# EAGLE design The electronic speed controller schematic (EAGLE 9.4.2)

## Sheet 1 of 6
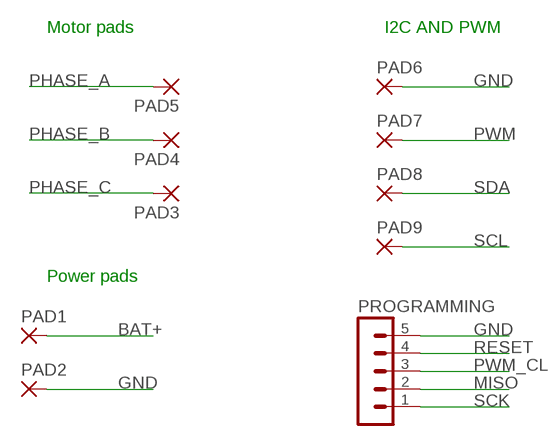
[diagram p0: schematic, sheet 1]

### Parts
PAD1  SMD5  [SMD2,54-5,08]
PAD2  SMD5  [SMD2,54-5,08]
PAD3  SMD5  [SMD2,54-5,08]
PAD4  SMD5  [SMD2,54-5,08]
PAD5  SMD5  [SMD2,54-5,08]
PAD6  SMD2  [SMD1,27-2,54]
PAD7  SMD2  [SMD1,27-2,54]
PAD8  SMD2  [SMD1,27-2,54]
PAD9  SMD2  [SMD1,27-2,54]
PROGRAMMING  MA05-1  [MA05-1]

### Nets
BAT+: PAD1.1(P) ; also sheet 3,4
GND: PAD2.1(P) PAD6.1(P) PROGRAMMING.5 ; also sheet 2,3,4,5,6
MISO: PROGRAMMING.2 ; also sheet 2
PHASE_A: PAD5.1(P) ; also sheet 5,6
PHASE_B: PAD4.1(P) ; also sheet 5,6
PHASE_C: PAD3.1(P) ; also sheet 5,6
PWM: PAD7.1(P) ; also sheet 2
PWM_CL: PROGRAMMING.3 ; also sheet 2,6
RESET: PROGRAMMING.4 ; also sheet 2
SCK: PROGRAMMING.1 ; also sheet 2
SCL: PAD9.1(P) ; also sheet 2
SDA: PAD8.1(P) ; also sheet 2

### Notes on the sheet
- Motor pads | I2C AND PWM
- Power pads

## Sheet 2 of 6
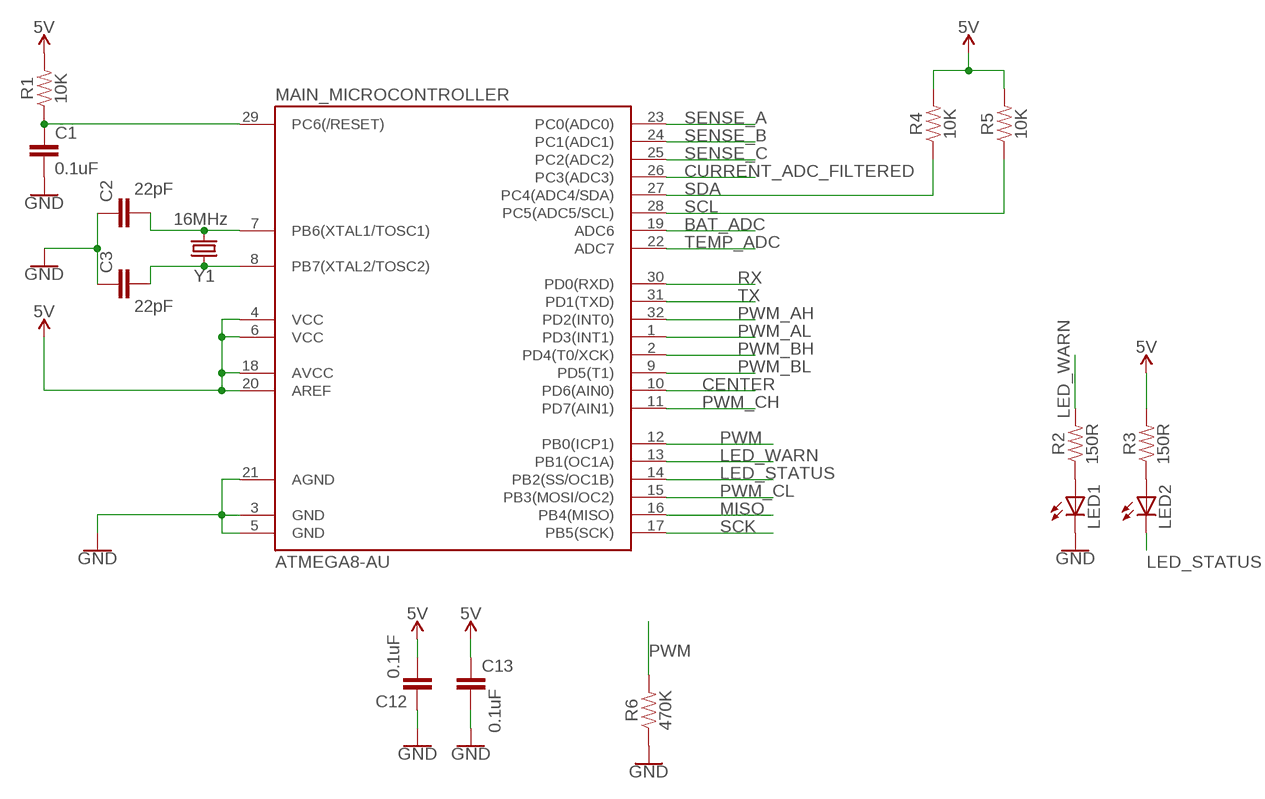
[diagram p1: schematic, sheet 2]

### Parts
C1  0.1uF  0.33UF/330NF-0805-50V-10%  [0805]
C2  22pF  0.33UF/330NF-0805-50V-10%  [0805]
C3  22pF  0.33UF/330NF-0805-50V-10%  [0805]
C12  0.1uF  0.33UF/330NF-0805-50V-10%  [0805]
C13  0.1uF  0.33UF/330NF-0805-50V-10%  [0805]
LED1  LEDCHIPLED_0805  [CHIPLED_0805]
LED2  LEDCHIPLED_0805  [CHIPLED_0805]
MAIN_MICROCONTROLLER  ATMEGA8-AU  [TQFP32-08]
R1  10K  0.3OHM-0805-1/8W-1%  [0805]
R2  150R  0.3OHM-0805-1/8W-1%  [0805]
R3  150R  0.3OHM-0805-1/8W-1%  [0805]
R4  10K  0.3OHM-0805-1/8W-1%  [0805]
R5  10K  0.3OHM-0805-1/8W-1%  [0805]
R6  470K  0.3OHM-0805-1/8W-1%  [0805]
Y1  16MHz  CRYSTAL-16MHZSMD-5X3.2  [CRYSTAL-SMD-5X3.2-4PAD]

### Nets
5V: C12.2 C13.1 MAIN_MICROCONTROLLER.4(VCC) MAIN_MICROCONTROLLER.6(VCC) MAIN_MICROCONTROLLER.18(AVCC) MAIN_MICROCONTROLLER.20(AREF) R1.2 R3.2 R4.2 R5.2 ; also sheet 3,4
BAT_ADC: MAIN_MICROCONTROLLER.19(ADC6) ; also sheet 3
CENTER: MAIN_MICROCONTROLLER.10(PD6(AIN0)) ; also sheet 5
CURRENT_ADC_FILTERED: MAIN_MICROCONTROLLER.26(PC3(ADC3)) ; also sheet 3
GND: C1.2 C2.1 C3.1 C12.1 C13.2 LED1.C MAIN_MICROCONTROLLER.3(GND) MAIN_MICROCONTROLLER.5(GND) MAIN_MICROCONTROLLER.21(AGND) R6.1 ; also sheet 1,3,4,5,6
LED_STATUS: LED2.C MAIN_MICROCONTROLLER.14(PB2(SS/OC1B))
LED_WARN: MAIN_MICROCONTROLLER.13(PB1(OC1A)) R2.2
MISO: MAIN_MICROCONTROLLER.16(PB4(MISO)) ; also sheet 1
N$2: C2.2 MAIN_MICROCONTROLLER.7(PB6(XTAL1/TOSC1)) Y1.3
N$3: C3.2 MAIN_MICROCONTROLLER.8(PB7(XTAL2/TOSC2)) Y1.1
N$4: LED1.A R2.1
N$5: LED2.A R3.1
PWM: MAIN_MICROCONTROLLER.12(PB0(ICP1)) R6.2 ; also sheet 1
PWM_AH: MAIN_MICROCONTROLLER.32(PD2(INT0)) ; also sheet 6
PWM_AL: MAIN_MICROCONTROLLER.1(PD3(INT1)) ; also sheet 6
PWM_BH: MAIN_MICROCONTROLLER.2(PD4(T0/XCK)) ; also sheet 6
PWM_BL: MAIN_MICROCONTROLLER.9(PD5(T1)) ; also sheet 6
PWM_CH: MAIN_MICROCONTROLLER.11(PD7(AIN1)) ; also sheet 6
PWM_CL: MAIN_MICROCONTROLLER.15(PB3(MOSI/OC2)) ; also sheet 1,6
RESET: C1.1 MAIN_MICROCONTROLLER.29(PC6(/RESET)) R1.1 ; also sheet 1
RX: MAIN_MICROCONTROLLER.30(PD0(RXD))
SCK: MAIN_MICROCONTROLLER.17(PB5(SCK)) ; also sheet 1
SCL: MAIN_MICROCONTROLLER.28(PC5(ADC5/SCL)) R5.1 ; also sheet 1
SDA: MAIN_MICROCONTROLLER.27(PC4(ADC4/SDA)) R4.1 ; also sheet 1
SENSE_A: MAIN_MICROCONTROLLER.23(PC0(ADC0)) ; also sheet 5
SENSE_B: MAIN_MICROCONTROLLER.24(PC1(ADC1)) ; also sheet 5
SENSE_C: MAIN_MICROCONTROLLER.25(PC2(ADC2)) ; also sheet 5
TEMP_ADC: MAIN_MICROCONTROLLER.22(ADC7) ; also sheet 3
TX: MAIN_MICROCONTROLLER.31(PD1(TXD))

## Sheet 3 of 6
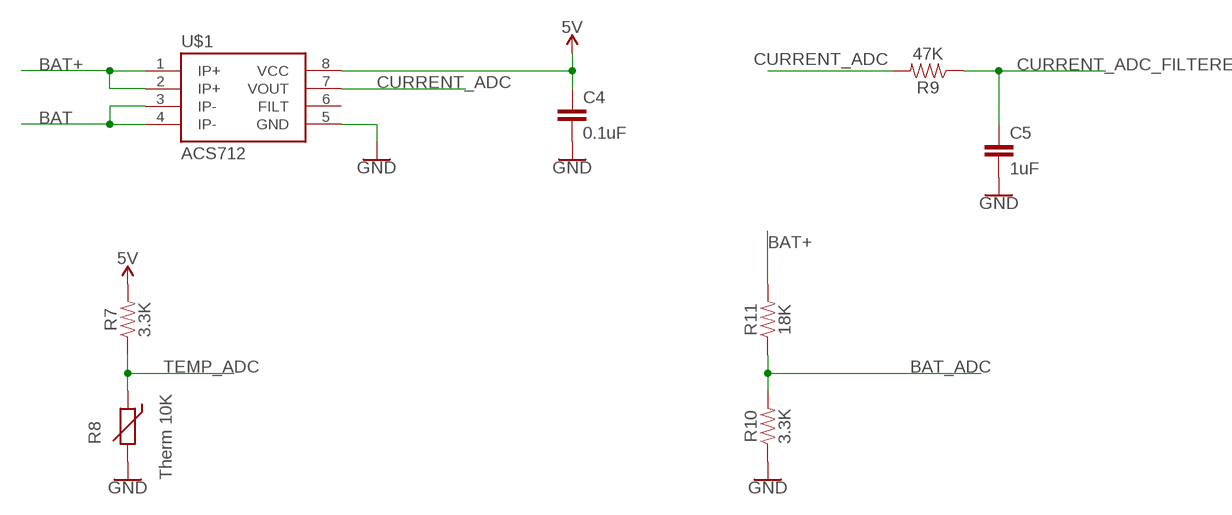
[diagram p2: schematic, sheet 3]

### Parts
C4  0.1uF  0.33UF/330NF-0805-50V-10%  [0805]
C5  1uF  CAP-1206  [1206]
R7  3.3K  0.3OHM-0805-1/8W-1%  [0805]
R8  Therm 10K  THERMISTOR-5  [R-5]
R9  47K  0.3OHM-0805-1/8W-1%  [0805]
R10  3.3K  0.3OHM-0805-1/8W-1%  [0805]
R11  18K  0.3OHM-0805-1/8W-1%  [0805]
U$1  ACS712  [SO08]

### Nets
5V: C4.1 R7.2 U$1.8(VCC) ; also sheet 2,4
BAT: U$1.3(IP-) U$1.4(IP-) ; also sheet 4,6
BAT+: R11.2 U$1.1(IP+) U$1.2(IP+) ; also sheet 1,4
BAT_ADC: R10.2 R11.1 ; also sheet 2
CURRENT_ADC: R9.2 U$1.7(VOUT)
CURRENT_ADC_FILTERED: C5.1 R9.1 ; also sheet 2
GND: C4.2 C5.2 R8.2 R10.1 U$1.5(GND) ; also sheet 1,2,4,5,6
TEMP_ADC: R7.1 R8.1 ; also sheet 2
Unconnected: U$1.6(FILT)

## Sheet 4 of 6
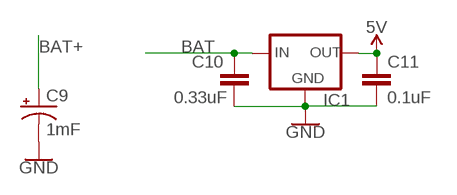
[diagram p3: schematic, sheet 4]

### Parts
C9  1mF  1000UF-RADIAL-5MM-25V-20%  [CPOL-RADIAL-5MM-10MM]
C10  0.33uF  CAP-0805  [0805]
C11  0.1uF  CAP-0805  [0805]
IC1  78LXX-SOT89  [SOT89]

### Nets
5V: C11.1 IC1.1(OUT) ; also sheet 2,3
BAT: C10.1 IC1.3(IN) ; also sheet 3,6
BAT+: C9.+ ; also sheet 1,3
GND: C9.- C10.2 C11.2 IC1.2(GND) ; also sheet 1,2,3,5,6

## Sheet 5 of 6
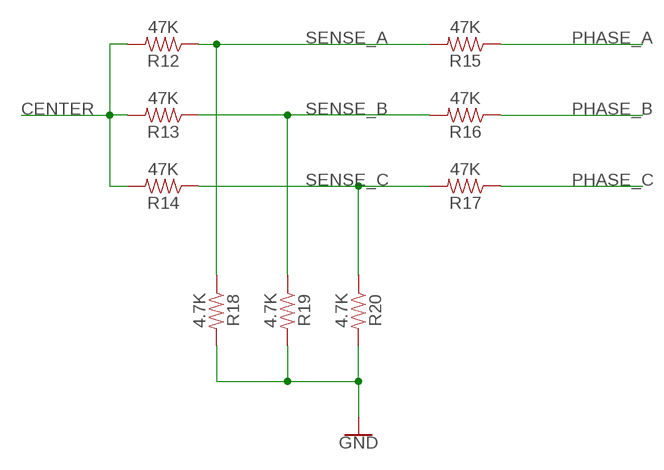
[diagram p4: schematic, sheet 5]

### Parts
R12  47K  0.3OHM-0805-1/8W-1%  [0805]
R13  47K  0.3OHM-0805-1/8W-1%  [0805]
R14  47K  0.3OHM-0805-1/8W-1%  [0805]
R15  47K  0.3OHM-0805-1/8W-1%  [0805]
R16  47K  0.3OHM-0805-1/8W-1%  [0805]
R17  47K  0.3OHM-0805-1/8W-1%  [0805]
R18  4.7K  0.3OHM-0805-1/8W-1%  [0805]
R19  4.7K  0.3OHM-0805-1/8W-1%  [0805]
R20  4.7K  0.3OHM-0805-1/8W-1%  [0805]

### Nets
CENTER: R12.2 R13.2 R14.2 ; also sheet 2
GND: R18.2 R19.2 R20.2 ; also sheet 1,2,3,4,6
PHASE_A: R15.1 ; also sheet 1,6
PHASE_B: R16.1 ; also sheet 1,6
PHASE_C: R17.1 ; also sheet 1,6
SENSE_A: R12.1 R15.2 R18.1 ; also sheet 2
SENSE_B: R13.1 R16.2 R19.1 ; also sheet 2
SENSE_C: R14.1 R17.2 R20.1 ; also sheet 2

## Sheet 6 of 6
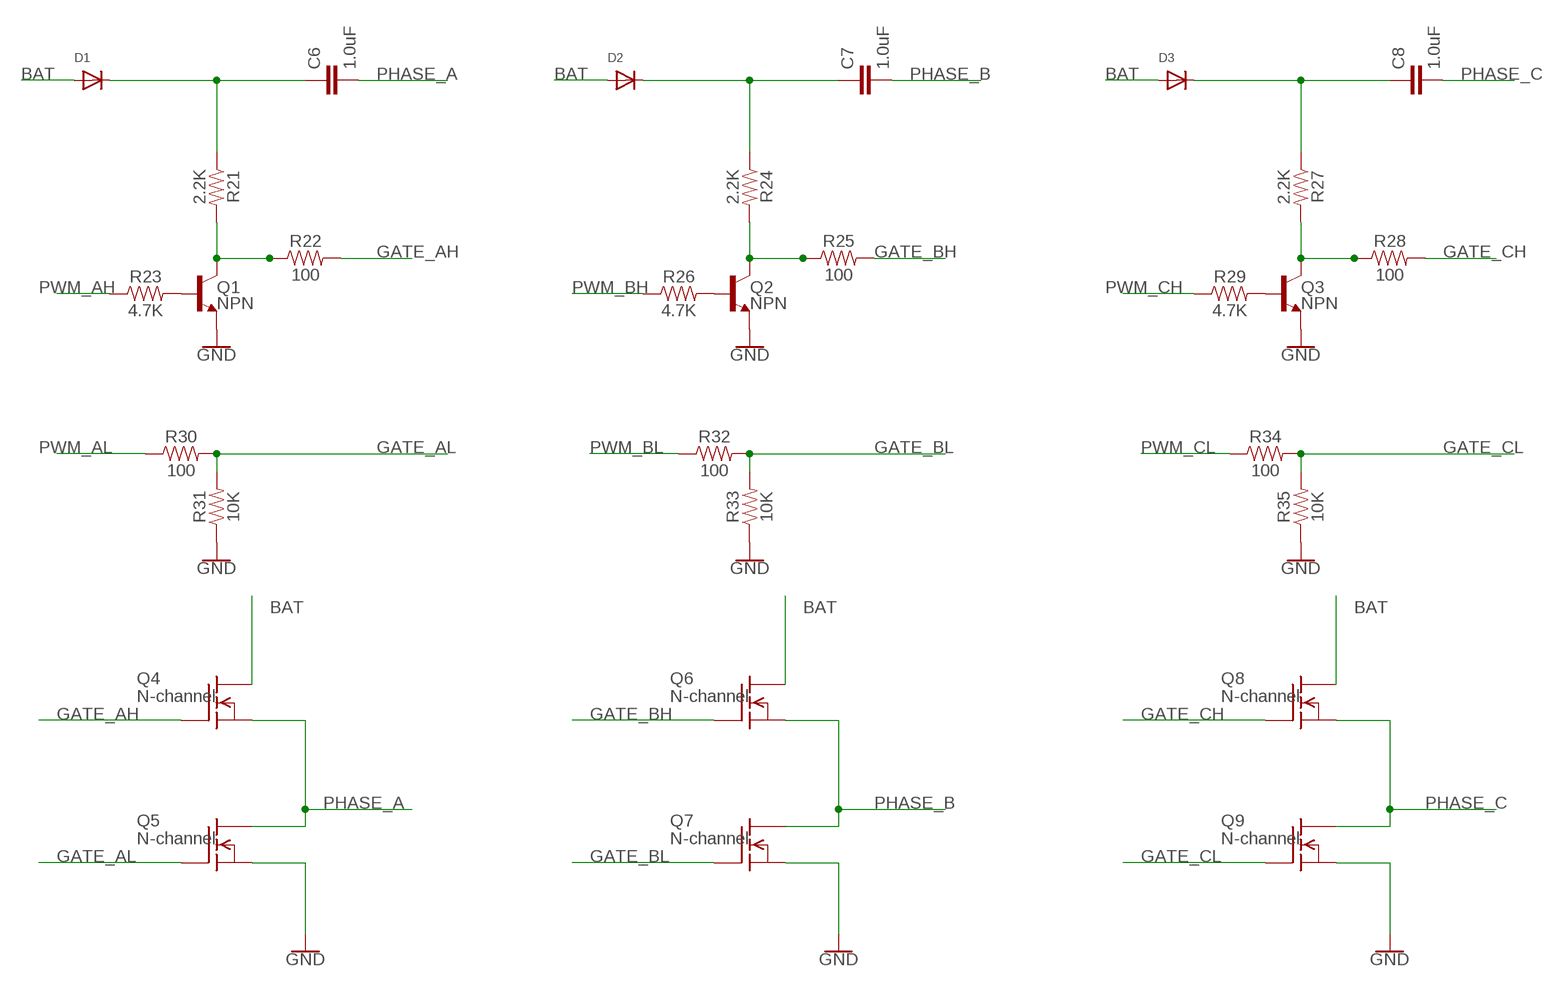
[diagram p5: schematic, sheet 6]

### Parts
C6  1.0uF  1.0UF-1206-50V-10%  [1206]
C7  1.0uF  1.0UF-1206-50V-10%  [1206]
C8  1.0uF  1.0UF-1206-50V-10%  [1206]
D1  DIODESOD-123  [SOD-123]
D2  DIODESOD-123  [SOD-123]
D3  DIODESOD-123  [SOD-123]
Q1  NPN  TRANS_NPN-MMBTA42  [SOT23-3]
Q2  NPN  TRANS_NPN-MMBTA42  [SOT23-3]
Q3  NPN  TRANS_NPN-MMBTA42  [SOT23-3]
Q4  N-channel  BSS296N-MOSFET_POWERESC  [TO252]
Q5  N-channel  BSS296N-MOSFET_POWERESC  [TO252]
Q6  N-channel  BSS296N-MOSFET_POWERESC  [TO252]
Q7  N-channel  BSS296N-MOSFET_POWERESC  [TO252]
Q8  N-channel  BSS296N-MOSFET_POWERESC  [TO252]
Q9  N-channel  BSS296N-MOSFET_POWERESC  [TO252]
R21  2.2K  0.3OHM-0805-1/8W-1%  [0805]
R22  100  0.3OHM-0805-1/8W-1%  [0805]
R23  4.7K  0.3OHM-0805-1/8W-1%  [0805]
R24  2.2K  0.3OHM-0805-1/8W-1%  [0805]
R25  100  0.3OHM-0805-1/8W-1%  [0805]
R26  4.7K  0.3OHM-0805-1/8W-1%  [0805]
R27  2.2K  0.3OHM-0805-1/8W-1%  [0805]
R28  100  0.3OHM-0805-1/8W-1%  [0805]
R29  4.7K  0.3OHM-0805-1/8W-1%  [0805]
R30  100  0.3OHM-0805-1/8W-1%  [0805]
R31  10K  0.3OHM-0805-1/8W-1%  [0805]
R32  100  0.3OHM-0805-1/8W-1%  [0805]
R33  10K  0.3OHM-0805-1/8W-1%  [0805]
R34  100  0.3OHM-0805-1/8W-1%  [0805]
R35  10K  0.3OHM-0805-1/8W-1%  [0805]

### Nets
BAT: D1.A D2.A D3.A Q4.2(D) Q6.2(D) Q8.2(D) ; also sheet 3,4
GATE_AH: Q4.1(G) R22.2
GATE_AL: Q5.1(G) R30.2 R31.2
GATE_BH: Q6.1(G) R25.2
GATE_BL: Q7.1(G) R32.2 R33.2
GATE_CH: Q8.1(G) R28.2
GATE_CL: Q9.1(G) R34.2 R35.2
GND: Q1.2(E) Q2.2(E) Q3.2(E) Q5.3(S) Q7.3(S) Q9.3(S) R31.1 R33.1 R35.1 ; also sheet 1,2,3,4,5
N$7: C6.1 D1.C R21.1
N$9: Q1.3(C) R21.2 R22.1
N$11: Q1.1(B) R23.2
N$14: C7.1 D2.C R24.1
N$15: Q2.3(C) R24.2 R25.1
N$17: Q2.1(B) R26.2
N$20: C8.1 D3.C R27.1
N$21: Q3.3(C) R27.2 R28.1
N$23: Q3.1(B) R29.2
PHASE_A: C6.2 Q4.3(S) Q5.2(D) ; also sheet 1,5
PHASE_B: C7.2 Q6.3(S) Q7.2(D) ; also sheet 1,5
PHASE_C: C8.2 Q8.3(S) Q9.2(D) ; also sheet 1,5
PWM_AH: R23.1 ; also sheet 2
PWM_AL: R30.1 ; also sheet 2
PWM_BH: R26.1 ; also sheet 2
PWM_BL: R32.1 ; also sheet 2
PWM_CH: R29.1 ; also sheet 2
PWM_CL: R34.1 ; also sheet 1,2

## Library data of the parts
C1-C4 C12 C13 = SparkFun-Capacitors:0.33UF/330NF: 0.33µF/330nF ceramic capacitors A capacitor is a passive two-terminal electrical component used to store electrical energy temporarily in an electric field.; PROD_ID: CAP-08469; VALUE: 0.33µF
C5 C10 C11 = SparkFun-Capacitors:CAP
C6-C8 = SparkFun-Capacitors:1.0UF: 1µF ceramic capacitors A capacitor is a passive two-terminal electrical component used to store electrical energy temporarily in an electric field.; PROD_ID: CAP-09822
C9 = SparkFun-Capacitors:1000UF: 1,000µF/1mF ceramic capacitors A capacitor is a passive two-terminal electrical component used to store electrical energy temporarily in an electric field. CAP-08070; PROD_ID: CAP-09538
D1-D3 = adafruit:DIODE: Diode SMADIODE - SMA Surface Mount Package 20V 1A Schottky Diode Digikey: 641-1014-6-ND DO-1N4148 - Through Hole Small Current Diode SOD-123 20V 1 A (.5mV Vf) Schottky Diode - Digikey: MBRX120TPMSCT-ND SOD-323 10V 570mA (.38mV Vf, 3ns) Schottky Diode - Digikey: ZLLS410CT-ND SOD-523 30V 30mA Schottky Diode (RB751S-40TE61) - Digikey: RB751S-40TE61CT-ND SOT23-R/W - SOT23 Package (R = Solder Paste/Reflow Ovens, W = Hand-Soldering) BAT54Film 40V 300mA - Digikey: 497-7162-1-ND
IC1 = v-reg-3:78LXX: VOLTAGE REGULATOR
LED1 LED2 = adafruit:LED: LED OSRAM: - CHIPLED LG R971, LG N971, LY N971, LG Q971, LY Q971, LO R971, LY R971 LH N974, LH R974 LS Q976, LO Q976, LY Q976 LO Q996 - Hyper CHIPLED LW Q18S LB Q993, LB Q99A, LB R99A - SideLED LS A670, LO A670, LY A670, LG A670, LP A670 LB A673, LV A673, LT A673, LW A673 LH A674 LY A675 LS A676, LA A676, LO A676, LY A676, LW A676 LS A679, LY A679, LG A679 - Hyper Micro SIDELED® LS Y876, LA Y876, LO Y876, LY Y876 LT Y87S - SmartLED LW L88C, LW L88S LB L89C, LB L89S, LG L890 LS L89K, LO L89K, LY L89K LS L896, LA L896, LO L896, LY L896 - TOPLED LS T670, LO T670, LY T670, LG T670, LP T670 LSG T670, LSP T670, LSY T670, LOP T670, LYG T670 LG T671, LOG T671, LSG T671 LB T673, LV T673, LT T673, LW T673 LH T674 LS T676, LA T676, LO T676, LY T676, LB T676, LH T676, LSB T676, LW T676 LB T67C, LV T67C, LT T67C, LS T67K, LO T67K, LY T67K, LW E67C LS E67B, LA E67B, LO E67B, LY E67B, LB E67C, LV E67C, LT E67C LW T67C LS T679, LY T679, LG T679 LS T770, LO T770, LY T770, LG T770, LP T770 LB T773, LV T773, LT T773, LW T773 LH T774 LS E675, LA E675, LY E675, LS T675 LS T776, LA T776, LO T776, LY T776, LB T776 LHGB T686 LT T68C, LB T68C - Hyper Mini TOPLED® LB M676 - Mini TOPLED Santana® LG M470 LS M47K, LO M47K, LY M47K Source: http://www.osram.convergy.de/
MAIN_MICROCONTROLLER = atmega8:ATMEGA8
PAD1-PAD5 = wirepad:SMD5: SMD PAD
PAD6-PAD9 = wirepad:SMD2: SMD PAD
PROGRAMMING = con-lstb:MA05-1: PIN HEADER; OC_FARNELL: unknown; OC_NEWARK: unknown
Q1-Q3 = SparkFun-DiscreteSemi:TRANS_NPN: NPN transistor Current controlled devices typically used to amplify current or used as a switch. BC547 - COM-08928 <http://www.sparkfun.com/products/8928> (TO-92 45V 100mA) (1.Collector 2.Base 3.Emitter) 2N3904 - COM-00521 <http://www.sparkfun.com/products/521> (TO-92 40V 200mA) (1.Emitter 2.Base 3.Collector) P2N2222A - COM-12852 <http://www.sparkfun.com/products/12852> (TO-92 40V 600mA) (1.Collector 2.Base 3.Emitter); PROD_ID: TRANS-09116; VALUE: 500mA/300V
Q4-Q9 = John:BSS296: N-Channel Enhancement MOSFET not checked
R1-R7 R9-R35 = SparkFun-Resistors:0.3OHM: 0.3Ω resistor A resistor is a passive two-terminal electrical component that implements electrical resistance as a circuit element. Resistors act to reduce current flow, and, at the same time, act to lower voltage levels within circuits. - Wikipedia; PROD_ID: RES-11622; VALUE: 0.3
R8 = varistor:THERMISTOR: THERMISTOR
U$1 = SparkFun-Sensors:ACS712: ACS712 Hall-effect-based isolated linear current sensor Datasheet <http://www.sparkfun.com/datasheets/BreakoutBoards/0712.pdf> SparkFun Products SparkFun Low Current Sensor Breakout - ACS712 <https://www.sparkfun.com/products/8883> (SEN-08883); PROD_ID: IC-08964
Y1 = SparkFun-Clocks:CRYSTAL-16MHZ: 16MHz Crystal Digikey Example <http://www.digikey.com/product-search/en?keywords=535-9122-1-ND> Frequency: 16MHz Frequency Stability: ±50ppm Frequency Tolerance: ±20ppm Load Capacitance: 18pF SparkFun Products: Pro Micro -5V/16MHz <https://www.sparkfun.com/products/12640> SparkFun Serial Enabled LCD Kit <https://www.sparkfun.com/products/10097>; PROD_ID: XTAL-08218; SF_ID: COM-00094

## Board
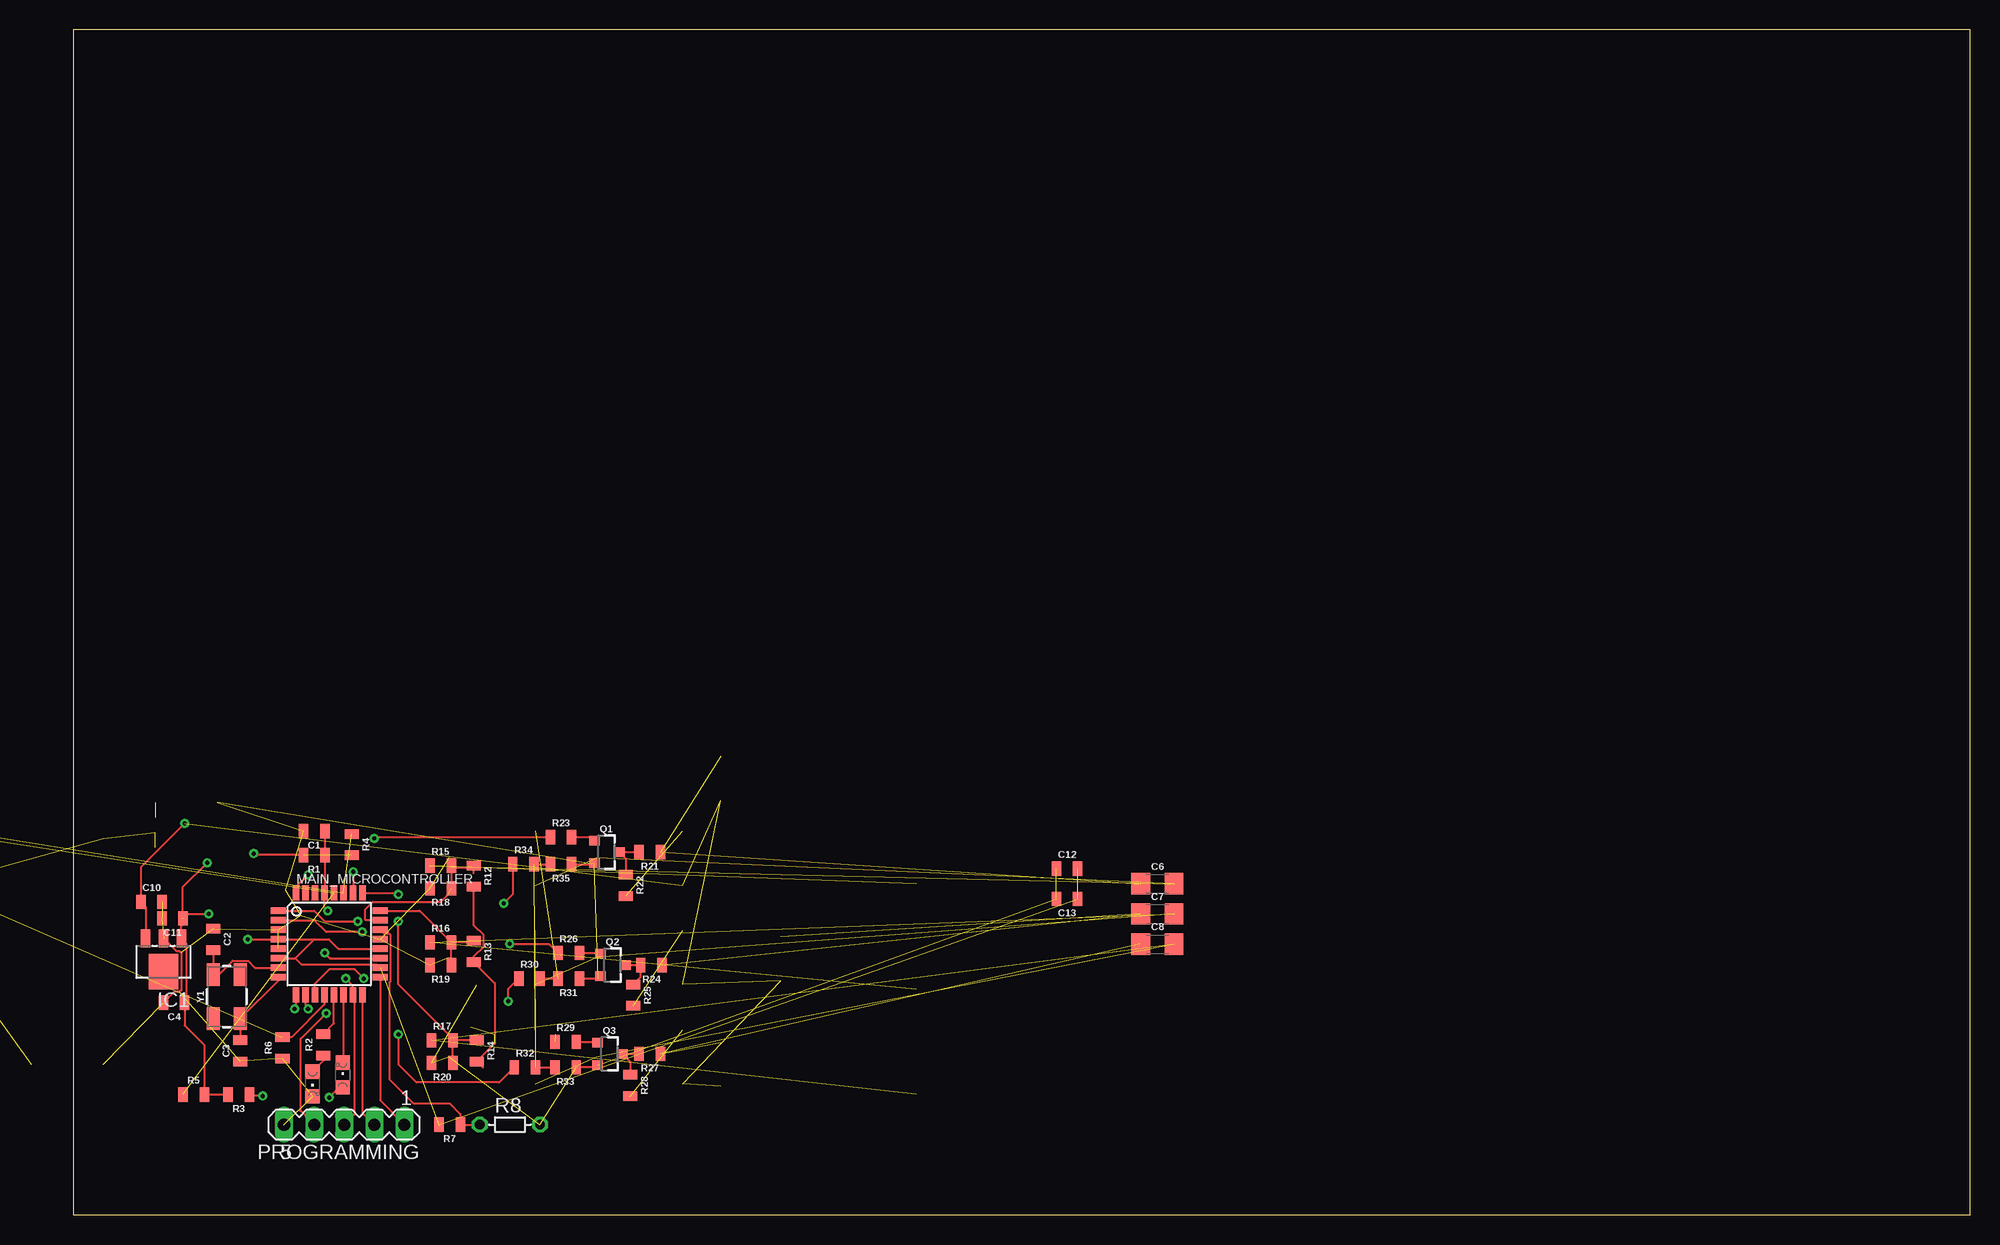
[diagram p6: board, top side]
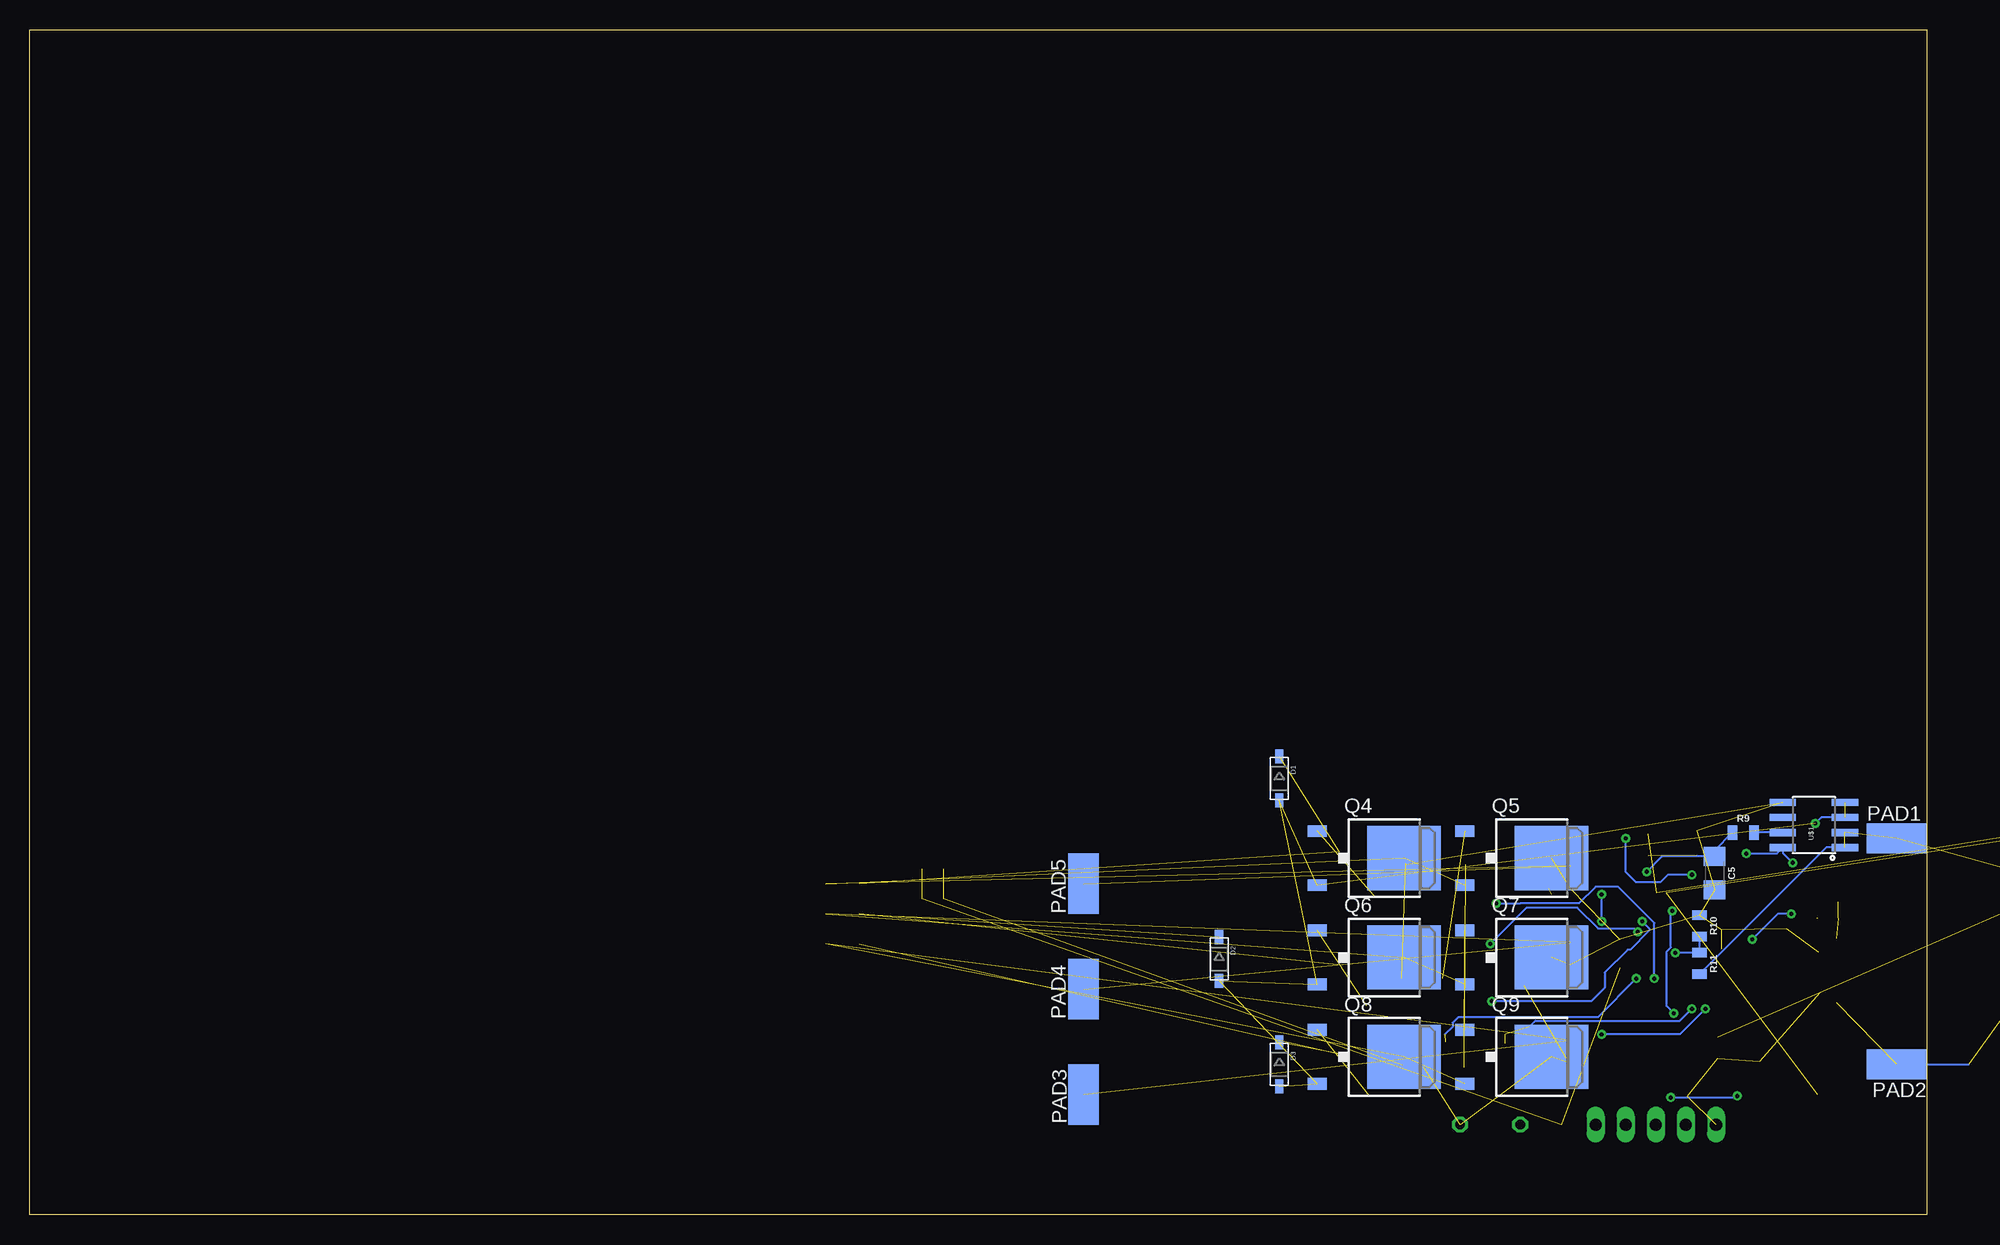
[diagram p7: board, bottom side, seen from below]

Size 160 x 100 mm. Coordinates in mm from the lower left corner, seen from the top.
Outline: 0,0 160,0 160,100 0,100 0,0
Copper layers (1*16): Top 0.035mm / dielectric 1.5mm / Bottom 0.035mm
Design rules "default": minimum track width 6mil, minimum drill 0.35mm, track to track 6mil, track to pad 6mil, pad to pad 6mil, via to via 6mil, smd to smd 6mil, copper to edge 40mil, drill to drill 6mil, minimum pad ring 10mil, minimum via ring 8mil, stop-mask expansion 4mil, vias tented up to drill 0mil, thermal gap 10mil

### Footprints (pad centres in the part's own frame; a part is rotated, then mirrored left to right if it is on the bottom)
0805 = smd 0.8 x 1.2: 1 -0.9,0; 2 0.9,0
1206 = smd 1.6 x 1.8: 1 -1.4,0; 2 1.4,0
CPOL-RADIAL-5MM-10MM = drill 0.9 pad 1.93 square: + 2.5,0 | drill 0.9 pad 1.93: - -2.5,0
SOD-123 = smd 1.2 x 0.7: A 1.85,0; C -1.85,0
SOT89 = smd 0.8 x 1.5: 1 -1.5,-1.75; 2 0,-1.75; 3 1.5,-1.75 | smd 2.5 x 3: 4 0,1.05
CHIPLED_0805 = smd 1.2 x 1.2: A 0,-1.05; C 0,1.05
TQFP32-08 = smd 1.27 x 0.559: 1 -4.293,2.8; 2 -4.293,2; 3 -4.293,1.2; 4 -4.293,0.4; 5 -4.293,-0.4; 6 -4.293,-1.2; 7 -4.293,-2; 8 -4.293,-2.8; 17 4.293,-2.8; 18 4.293,-2; 19 4.293,-1.2; 20 4.293,-0.4; 21 4.293,0.4; 22 4.293,1.2; 23 4.293,2; 24 4.293,2.8 | smd 0.559 x 1.27: 9 -2.8,-4.293; 10 -2,-4.293; 11 -1.2,-4.293; 12 -0.4,-4.293; 13 0.4,-4.293; 14 1.2,-4.293; 15 2,-4.293; 16 2.8,-4.293; 25 2.8,4.293; 26 2,4.293; 27 1.2,4.293; 28 0.4,4.293; 29 -0.4,4.293; 30 -1.2,4.293; 31 -2,4.293; 32 -2.8,4.293
SMD2,54-5,08 = smd 2.54 x 5.08: 1 0,0
SMD1,27-2,54 = smd 1.27 x 2.54: 1 0,0
MA05-1 = drill 1.016 long: 1 -5.08,0; 2 -2.54,0; 3 0,0; 4 2.54,0; 5 5.08,0
SOT23-3 = smd 0.8 x 0.9: 1 -0.95,-1; 2 0.95,-1; 3 0,1.1
TO252 = smd 1 x 1.6: 1 -2.28,-4.8; 2 2.28,-4.8 | smd 5.4 x 6.2: 3 0,2.5
R-5 = drill 0.813 octagon: 1 -2.54,0; 2 2.54,0
SO08 = smd 0.61 x 2.21: 1 -1.905,-2.616; 2 -0.635,-2.616; 3 0.635,-2.616; 4 1.905,-2.616; 5 1.905,2.616; 6 0.635,2.616; 7 -0.635,2.616; 8 -1.905,2.616
CRYSTAL-SMD-5X3.2-4PAD = smd 1.9 x 1.1: 1 -1.85,-1.15; 2 1.85,-1.15; 3 1.85,1.15; 4 -1.85,1.15

### Placement (x,y rotation side)
C1  20.32,32.38 180 top
C2  11.81,23.24 270 top
C3  14.1,13.84 90 top
C4  8.51,17.91 180 top
C5  17.91,28.83 270 bottom
C6  91.44,27.94 0 top
C7  91.44,25.4 0 top
C8  91.44,22.86 0 top
C9  -11.43,25.4 90 top  (outside the outline)
C10  6.6,26.42 0 top
C11  8.38,25.02 180 top
C12  83.82,29.21 0 top
C13  83.82,26.67 180 top
D1  54.61,36.83 270 bottom
D2  59.69,21.59 270 bottom
D3  54.61,12.7 270 bottom
IC1  7.62,21.59 180 top
LED1  20.19,11.05 180 top
LED2  22.73,11.81 0 top
MAIN_MICROCONTROLLER  21.59,22.86 0 top
PAD1  2.54,31.75 270 bottom
PAD2  2.54,12.7 90 bottom
PAD3  71.12,10.16 180 bottom
PAD4  71.12,19.05 0 bottom
PAD5  71.12,27.94 0 bottom
PAD6  -19.05,34.29 0 top  (outside the outline)
PAD7  -26.67,34.29 0 top  (outside the outline)
PAD8  -21.59,34.29 0 top  (outside the outline)
PAD9  -24.13,34.29 0 top  (outside the outline)
PROGRAMMING  22.86,7.62 180 top
Q1  44.96,30.61 270 top
Q2  45.47,21.08 270 top
Q3  45.21,13.59 270 top
Q4  46.61,30.1 270 bottom
Q5  34.16,30.1 270 bottom
Q6  46.61,21.72 270 bottom
Q7  34.16,21.72 270 bottom
Q8  46.61,13.34 270 bottom
Q9  34.16,13.34 270 bottom
R1  20.32,30.35 180 top
R2  21.08,14.35 90 top
R3  13.97,10.16 180 top
R4  23.5,31.24 270 top
R5  10.16,10.16 0 top
R6  17.65,14.1 90 top
R7  31.75,7.62 180 top
R8  36.83,7.62 0 top
R9  15.49,32.26 0 bottom
R10  19.18,24.38 270 bottom
R11  19.18,21.21 270 bottom
R12  33.78,28.57 270 top
R13  33.78,22.23 270 top
R14  34.04,13.84 270 top
R15  30.99,29.46 0 top
R16  30.99,22.99 0 top
R17  31.11,14.73 0 top
R18  30.99,27.56 180 top
R19  30.99,21.08 180 top
R20  31.11,12.83 180 top
R21  48.64,30.61 180 top
R22  46.61,27.81 270 top
R23  41.15,31.88 0 top
R24  48.77,21.08 180 top
R25  47.24,18.54 270 top
R26  41.78,22.1 0 top
R27  48.64,13.59 180 top
R28  46.99,10.92 270 top
R29  41.53,14.61 0 top
R30  38.48,19.94 0 top
R31  41.78,19.94 180 top
R32  38.1,12.45 0 top
R33  41.53,12.45 180 top
R34  37.97,29.59 0 top
R35  41.15,29.59 180 top
U$1  9.53,32.89 90 bottom
Y1  12.95,18.41 90 top

### Tracks (layer width: path | path; a pad name or v marks a point on that pad's centre or on a via)
5V  (via drill 0.35)  (5 unrouted)
  Top 0.152: C11.1 9.66,25.4 v11.43,25.4 | v14.73,23.24 17.28,23.24 MAIN_MICROCONTROLLER.4 20.32,23.26 | 20.32,23.26 21.57,23.26 22.37,22.46 MAIN_MICROCONTROLLER.20 | MAIN_MICROCONTROLLER.6 18.72,21.66 | 18.72,21.66 20.32,23.26 | R1.2 15.37,30.35 v15.24,30.48 | v11.3,29.72 9.2,27.62 9.2,25.02 9.12,24.37 IC1.1 9.54,22.92 9.54,18.03 C4.1 9.41,15.99 11.05,14.35 11.05,10.17 R5.2 R3.2 | MAIN_MICROCONTROLLER.18 25.63,21.11 19.27,21.11 18.72,21.66
  Bottom 0.152: v11.43,25.4 12.57,25.4 v14.73,23.24 | v15.24,30.48 12.65,30.48 U$1.8 12.14,30.56 v11.3,29.72
BAT  (via drill 0.35)  (7 unrouted)
  Top 0.152: v9.4,33.02 5.7,29.33 C10.1 6.12,26 IC1.3
  Bottom 0.152: U$1.3 8.89,33.53 v9.4,33.02
BAT+  (3 unrouted)
  Bottom 0.152: U$1.1 8.5,30.99 R11.2
BAT_ADC  (via drill 0.35)
  Top 0.152: v21.21,22.1 21.65,21.66 MAIN_MICROCONTROLLER.19
  Bottom 0.152: R10.2 R11.1 21.2,22.11 v21.21,22.1
CENTER  (via drill 0.35)  (2 unrouted)
  Top 0.152: 34.54,12.44 R14.2 35.56,14.47 35.56,19.55 R13.2 33.78,21.8 34.61,22.63 34.61,23.62 33.78,24.45 R12.2 | MAIN_MICROCONTROLLER.10 19.59,17.62 v19.81,17.4
  Bottom 0.152: v19.81,17.4 20.83,16.38 33.02,16.38 33.53,15.88
CURRENT_ADC
  Bottom 0.152: U$1.7 R9.2
CURRENT_ADC_FILTERED  (via drill 0.35)
  Top 0.152: v23.62,28.96 23.62,27.18 MAIN_MICROCONTROLLER.26
  Bottom 0.152: v23.62,28.96 22.35,30.23 C5.1 17.91,30.75 R9.1
GATE_AH  (1 unrouted)
GATE_AL  (1 unrouted)
  Top 0.152: R30.2 R31.2
GATE_BH  (1 unrouted)
GATE_BL  (1 unrouted)
  Top 0.152: R32.2 R33.2
GATE_CH  (1 unrouted)
GATE_CL  (1 unrouted)
  Top 0.152: R34.2 R35.2
GND  (29 unrouted)
  Top 0.152: 7.48,23.2 IC1.2 8.69,22.27 8.96,22.27 9.1,22.14 9.1,18.95 8.96,18.81 8.51,18.81 C4.2 | 7.5,25.04 C11.2 | R35.1 43.89,29.59 Q1.2 | R31.1 44.27,19.94 Q2.2 | Q3.2 44.02,12.45 R33.1
  Bottom 0.152: PAD2.1 -3.52,12.7 | Q7.3 34.01,19.37
LED_STATUS
  Top 0.152: LED2.C 22.79,12.92 MAIN_MICROCONTROLLER.14
LED_WARN
  Top 0.152: R2.2 21.99,16.16 MAIN_MICROCONTROLLER.13
MISO
  Top 0.152: MAIN_MICROCONTROLLER.16 24.39,8.63 PROGRAMMING.2
N$2
  Top 0.152: MAIN_MICROCONTROLLER.7 15.33,20.86 14.75,21.44 13.46,21.44 12.28,20.27 Y1.3 C2.2
N$3
  Top 0.152: MAIN_MICROCONTROLLER.8 17.3,19.76 Y1.1 C3.2
N$4
  Top 0.152: R2.1 21.08,12.99 LED1.A
N$5  (via drill 0.35)
  Top 0.152: 22.47,11.18 LED2.A 22.45,10.76 v21.59,9.91 | v16,10.03 15,10.03 R3.1
  Bottom 0.152: v21.59,9.91 16,9.91 v16,10.03
N$7  (2 unrouted)
N$9
  Top 0.152: R21.2 Q1.3 46.61,30.06 R22.1
N$11
  Top 0.152: R23.2 43.64,31.88 Q1.1
N$14  (2 unrouted)
N$15
  Top 0.152: Q2.3 R24.2 47.87,20.07 R25.1
N$17
  Top 0.152: R26.2 44.4,22.1 Q2.1
N$20  (2 unrouted)
N$21
  Top 0.152: R27.2 Q3.3 46.99,12.91 R28.1
N$23
  Top 0.152: R29.2 44.15,14.61 Q3.1
PHASE_A  (4 unrouted)
PHASE_B  (4 unrouted)
PHASE_C  (4 unrouted)
PWM  (1 unrouted)
  Top 0.152: MAIN_MICROCONTROLLER.12 21.19,17.76 18.43,15 R6.2
PWM_AH  (via drill 0.35)
  Top 0.152: MAIN_MICROCONTROLLER.32 18.79,27.68 v19.81,28.7 | v25.4,31.75 25.53,31.88 R23.1
  Bottom 0.152: v19.81,28.7 21.84,28.7 22.48,28.07 24.51,28.07 25.4,28.96 v25.4,31.75
PWM_AL  (via drill 0.35)
  Top 0.152: MAIN_MICROCONTROLLER.1 20.31,25.66 21.21,24.77 v24,24.77 | v36.7,18.03 36.7,19.06 R30.1
  Bottom 0.152: v24,24.77 23.4,24.16 23.4,24.01 25.02,22.38 25.25,22.38 27.18,20.45 27.18,19.18 28.32,18.03 v36.7,18.03
PWM_BH  (via drill 0.35)
  Top 0.152: MAIN_MICROCONTROLLER.2 20.35,24.86 21.34,23.88 v24.38,23.88 | v36.83,22.86 40.12,22.86 R26.1
  Bottom 0.152: v24.38,23.88 24.67,24.16 27.71,24.16 29.46,25.91 33.78,25.91 v36.83,22.86
PWM_BL  (via drill 0.35)
  Top 0.152: MAIN_MICROCONTROLLER.9 18.79,17.52 v18.67,17.4 | v27.43,15.24 27.43,12.7 28.96,11.18 35.93,11.18 R32.1
  Bottom 0.152: v18.67,17.4 20.83,15.24 v27.43,15.24
PWM_CH  (via drill 0.35)  (1 unrouted)
  Top 0.152: MAIN_MICROCONTROLLER.11 20.39,19.5 21.59,20.7 23.75,20.7 v24.51,19.94
  Bottom 0.152: v24.51,19.94 27.76,16.69 39.51,16.69 39.99,16.21 39.99,15.89 40.64,15.24
PWM_CL  (via drill 0.35)
  Top 0.152: PROGRAMMING.3 23.72,8.48 23.72,18.44 MAIN_MICROCONTROLLER.15 23.59,19.34 v22.99,19.94 | R34.1 37.07,27.04 v36.32,26.29
  Bottom 0.152: v22.99,19.94 22.99,24.64 26.04,27.69 27.94,27.69 29.34,26.29 34.29,26.29 34.67,26.29 v36.32,26.29
RESET  (via drill 0.35)
  Top 0.152: C1.1 R1.1 21.22,27.18 MAIN_MICROCONTROLLER.29 21.19,25.93 v21.46,25.65 | PROGRAMMING.4 19.18,8.76 19.18,14.86 v21.34,17.02
  Bottom 0.152: PROGRAMMING.4 20.32,7.91 | v21.46,25.65 21.59,25.53 21.59,22.57 21.94,22.22 21.94,17.62 v21.34,17.02
SCK
  Top 0.152: MAIN_MICROCONTROLLER.17 25.88,9.68 PROGRAMMING.1
SCL  (2 unrouted)
SDA  (2 unrouted)
SENSE_A  (1 unrouted)
  Top 0.152: 33.78,28.83 33.78,29.34 | 33.78,29.34 R12.1 | 25.4,24.86 MAIN_MICROCONTROLLER.23 24.67,24.86 24.64,24.89 24.64,25.78 25.27,26.42 30.99,26.42 31.62,27.05 | R18.1 R15.2 32.02,29.34 33.78,29.34
SENSE_B
  Top 0.152: 34.02,23.37 R13.1 | 33.9,23.24 R13.1 | R13.1 33.64,22.99 R16.2 | R19.1 R16.2 | MAIN_MICROCONTROLLER.24 29.21,25.66 R16.2
SENSE_C  (via drill 0.35)
  Top 0.152: MAIN_MICROCONTROLLER.25 27.43,27.15 v27.43,27.05 | R14.1 32.03,14.74 R17.2 | R20.1 R17.2 | v27.43,24.77 27.43,19.43 32.02,14.85 R17.2
  Bottom 0.152: v27.43,24.77 v27.43,27.05
TEMP_ADC
  Top 0.152: MAIN_MICROCONTROLLER.22 26.18,23.77 26.61,23.77 26.75,23.63 26.75,19.69 26.67,19.61 26.67,11.43 28.7,9.4 31.75,9.4 32.65,8.5 R7.1 R8.1